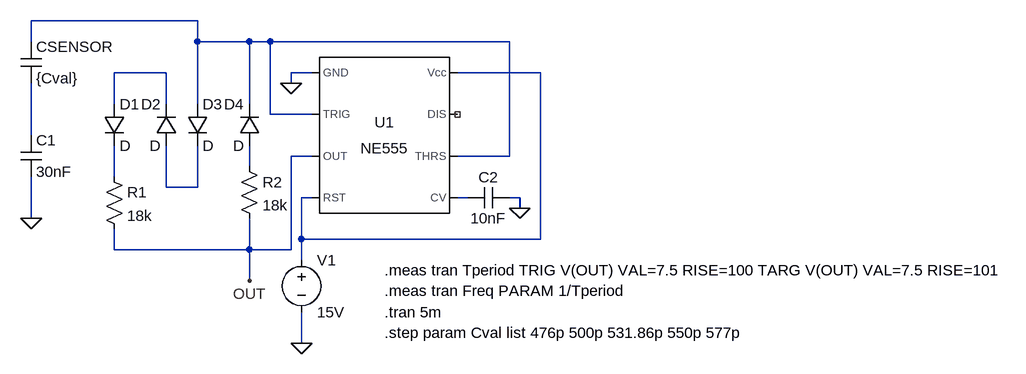
[diagram p0: schematic Humidity_555.asc]
Humidity_555.asc, the LTspice schematic file:
Version 4.1
SHEET 1 1212 680
WIRE -80 0 -336 0
WIRE -336 32 -336 0
WIRE -80 32 -80 0
WIRE 0 32 -80 32
WIRE 32 32 0 32
WIRE 400 32 32 32
WIRE -128 80 -208 80
WIRE 96 80 64 80
WIRE 448 80 320 80
WIRE 64 96 64 80
WIRE -208 128 -208 80
WIRE -128 128 -128 80
WIRE -80 128 -80 32
WIRE 0 128 0 32
WIRE 32 144 32 32
WIRE 96 144 32 144
WIRE -336 176 -336 96
WIRE 96 208 64 208
WIRE 400 208 400 32
WIRE 400 208 320 208
WIRE 0 224 0 192
WIRE -208 240 -208 192
WIRE -128 256 -128 192
WIRE -80 256 -80 192
WIRE -80 256 -128 256
WIRE 96 272 80 272
WIRE 336 272 320 272
WIRE 416 272 400 272
WIRE 416 288 416 272
WIRE -336 304 -336 240
WIRE 80 336 80 272
WIRE 448 336 448 80
WIRE 448 336 80 336
WIRE -208 352 -208 320
WIRE 0 352 0 304
WIRE 0 352 -208 352
WIRE 64 352 64 208
WIRE 64 352 0 352
WIRE 80 368 80 336
WIRE 0 400 0 352
WIRE 80 496 80 448
FLAG -336 304 0
FLAG 416 288 0
FLAG 80 496 0
FLAG 64 96 0
FLAG 0 400 OUT
SYMBOL Misc\\NE555 208 176 R0
SYMATTR InstName U1
SYMBOL cap -352 32 R0
SYMATTR InstName CSENSOR
SYMATTR Value {Cval}
SYMBOL cap -352 176 R0
SYMATTR InstName C1
SYMATTR Value 30nF
SYMBOL diode -224 128 R0
SYMATTR InstName D1
SYMBOL diode -112 192 R180
WINDOW 0 24 64 Left 2
WINDOW 3 24 0 Left 2
SYMATTR InstName D2
SYMBOL res -224 224 R0
SYMATTR InstName R1
SYMATTR Value 18k
SYMBOL diode -96 128 R0
SYMATTR InstName D3
SYMBOL diode 16 192 R180
WINDOW 0 24 64 Left 2
WINDOW 3 24 0 Left 2
SYMATTR InstName D4
SYMBOL res -16 208 R0
SYMATTR InstName R2
SYMATTR Value 18k
SYMBOL voltage 80 352 R0
SYMATTR InstName V1
SYMATTR Value 15V
SYMBOL cap 400 256 R90
WINDOW 0 0 32 VBottom 2
WINDOW 3 32 32 VTop 2
SYMATTR InstName C2
SYMATTR Value 10nF
TEXT 208 448 Left 2 !.tran 5m
TEXT 208 384 Left 2 !.meas tran Tperiod TRIG V(OUT) VAL=7.5 RISE=100 TARG V(OUT) VAL=7.5 RISE=101\n.meas tran Freq PARAM 1/Tperiod
TEXT 208 480 Left 2 !.step param Cval list 476p 500p 531.86p 550p 577p

The netlist it stands for:
* Humidity_555.asc
X§U1 0 N001 OUT N003 N008 N001 NC_01 N003 NE555  ; pins GND TRIG OUT RST CV THRS DIS Vcc
CSENSOR N001 N004 {Cval}
C1 N004 0 30nF
D1 N002 N006 D
D2 N007 N002 D
R1 N006 OUT 18k
D3 N001 N007 D
D4 N005 N001 D
R2 N005 OUT 18k
V1 N003 0 15V
C2 0 N008 10nF
.model D D
.lib standard.dio
.tran 5m
.meas tran Tperiod TRIG V(OUT) VAL=7.5 RISE=100 TARG V(OUT) VAL=7.5 RISE=101
.meas tran Freq PARAM 1/Tperiod
.step param Cval list 476p 500p 531.86p 550p 577p
.lib NE555.sub
.backanno
.end